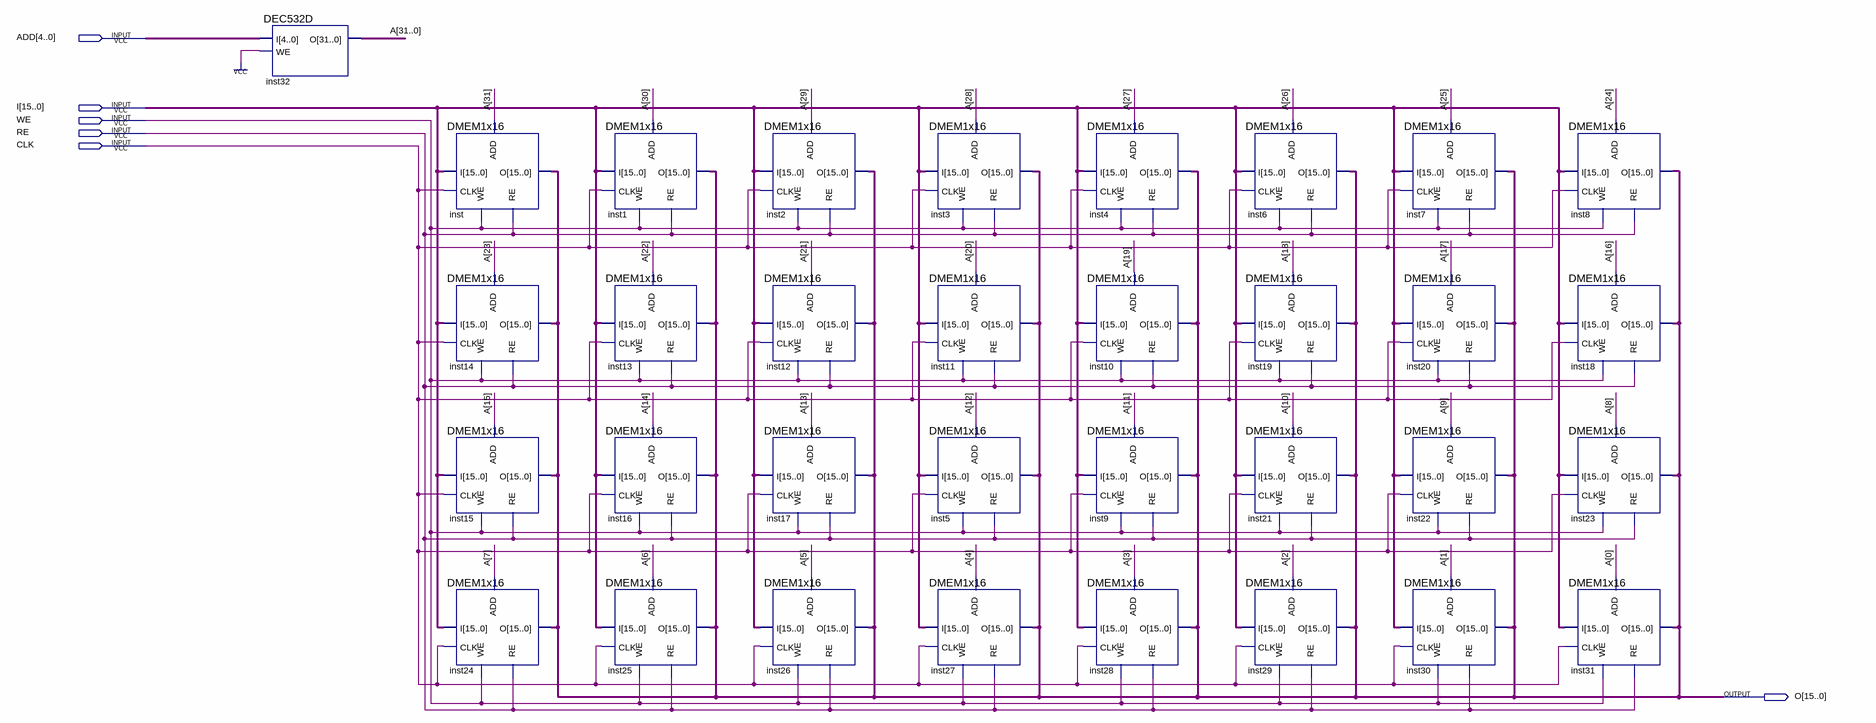
[diagram p0: schematic sheet]
// Quartus schematic DMEM32x16.bdf as structural Verilog: 33 symbols, 6 pins
module DMEM32x16 (
  input  [4:0] ADD,
  input  [15:0] I,
  input  WE,
  input  RE,
  input  CLK,
  output [15:0] O
);

  wire [31:0] A;

  DEC532D inst32 (.I(ADD), .WE(1'b1), .O(A));
  DMEM1x16 inst (.I(I), .ADD(A[31]), .CLK(CLK), .WE(WE), .RE(RE), .O(O));
  DMEM1x16 inst14 (.I(I), .ADD(A[23]), .CLK(CLK), .WE(WE), .RE(RE), .O(O));
  DMEM1x16 inst15 (.I(I), .ADD(A[15]), .CLK(CLK), .WE(WE), .RE(RE), .O(O));
  DMEM1x16 inst24 (.I(I), .ADD(A[7]), .CLK(CLK), .WE(WE), .RE(RE), .O(O));
  DMEM1x16 inst1 (.I(I), .ADD(A[30]), .CLK(CLK), .WE(WE), .RE(RE), .O(O));
  DMEM1x16 inst13 (.I(I), .ADD(A[22]), .CLK(CLK), .WE(WE), .RE(RE), .O(O));
  DMEM1x16 inst16 (.I(I), .ADD(A[14]), .CLK(CLK), .WE(WE), .RE(RE), .O(O));
  DMEM1x16 inst25 (.I(I), .ADD(A[6]), .CLK(CLK), .WE(WE), .RE(RE), .O(O));
  DMEM1x16 inst2 (.I(I), .ADD(A[29]), .CLK(CLK), .WE(WE), .RE(RE), .O(O));
  DMEM1x16 inst12 (.I(I), .ADD(A[21]), .CLK(CLK), .WE(WE), .RE(RE), .O(O));
  DMEM1x16 inst17 (.I(I), .ADD(A[13]), .CLK(CLK), .WE(WE), .RE(RE), .O(O));
  DMEM1x16 inst26 (.I(I), .ADD(A[5]), .CLK(CLK), .WE(WE), .RE(RE), .O(O));
  DMEM1x16 inst3 (.I(I), .ADD(A[28]), .CLK(CLK), .WE(WE), .RE(RE), .O(O));
  DMEM1x16 inst11 (.I(I), .ADD(A[20]), .CLK(CLK), .WE(WE), .RE(RE), .O(O));
  DMEM1x16 inst5 (.I(I), .ADD(A[12]), .CLK(CLK), .WE(WE), .RE(RE), .O(O));
  DMEM1x16 inst27 (.I(I), .ADD(A[4]), .CLK(CLK), .WE(WE), .RE(RE), .O(O));
  DMEM1x16 inst4 (.I(I), .ADD(A[27]), .CLK(CLK), .WE(WE), .RE(RE), .O(O));
  DMEM1x16 inst10 (.I(I), .ADD(A[19]), .CLK(CLK), .WE(WE), .RE(RE), .O(O));
  DMEM1x16 inst9 (.I(I), .ADD(A[11]), .CLK(CLK), .WE(WE), .RE(RE), .O(O));
  DMEM1x16 inst28 (.I(I), .ADD(A[3]), .CLK(CLK), .WE(WE), .RE(RE), .O(O));
  DMEM1x16 inst6 (.I(I), .ADD(A[26]), .CLK(CLK), .WE(WE), .RE(RE), .O(O));
  DMEM1x16 inst19 (.I(I), .ADD(A[18]), .CLK(CLK), .WE(WE), .RE(RE), .O(O));
  DMEM1x16 inst21 (.I(I), .ADD(A[10]), .CLK(CLK), .WE(WE), .RE(RE), .O(O));
  DMEM1x16 inst29 (.I(I), .ADD(A[2]), .CLK(CLK), .WE(WE), .RE(RE), .O(O));
  DMEM1x16 inst7 (.I(I), .ADD(A[25]), .CLK(CLK), .WE(WE), .RE(RE), .O(O));
  DMEM1x16 inst20 (.I(I), .ADD(A[17]), .CLK(CLK), .WE(WE), .RE(RE), .O(O));
  DMEM1x16 inst22 (.I(I), .ADD(A[9]), .CLK(CLK), .WE(WE), .RE(RE), .O(O));
  DMEM1x16 inst30 (.I(I), .ADD(A[1]), .CLK(CLK), .WE(WE), .RE(RE), .O(O));
  DMEM1x16 inst8 (.I(I), .ADD(A[24]), .CLK(CLK), .WE(WE), .RE(RE), .O(O));
  DMEM1x16 inst18 (.I(I), .ADD(A[16]), .CLK(CLK), .WE(WE), .RE(RE), .O(O));
  DMEM1x16 inst23 (.I(I), .ADD(A[8]), .CLK(CLK), .WE(WE), .RE(RE), .O(O));
  DMEM1x16 inst31 (.I(I), .ADD(A[0]), .CLK(CLK), .WE(WE), .RE(RE), .O(O));
endmodule
